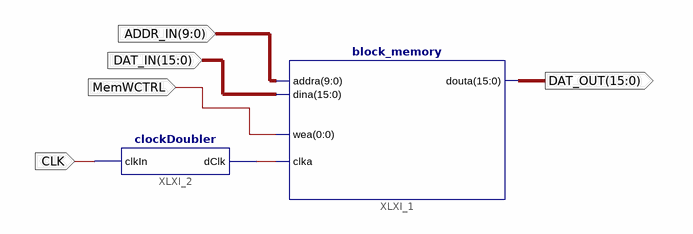
[diagram p0: schematic sheet 1]
// Xilinx ISE schematic MEMORY.sch (spartan3e) as structural Verilog: 2 symbols, 5 ports
module MEMORY (
  input  CLK,
  input  [9:0] ADDR_IN,
  input  [15:0] DAT_IN,
  input  MemWCTRL,
  output [15:0] DAT_OUT
);

  wire XLXN_1;

  block_memory XLXI_1 (.addra(ADDR_IN), .dina(DAT_IN), .wea(MemWCTRL), .clka(XLXN_1), .douta(DAT_OUT));
  clockDoubler XLXI_2 (.clkIn(CLK), .dClk(XLXN_1));
endmodule
